# Altium schematic sheet top_level_sheet.SchDoc
size A4; Author: Luis Henrique DAvila Possatti; Organization: University of Campinas; SheetNumber: 1; SheetTotal: 10
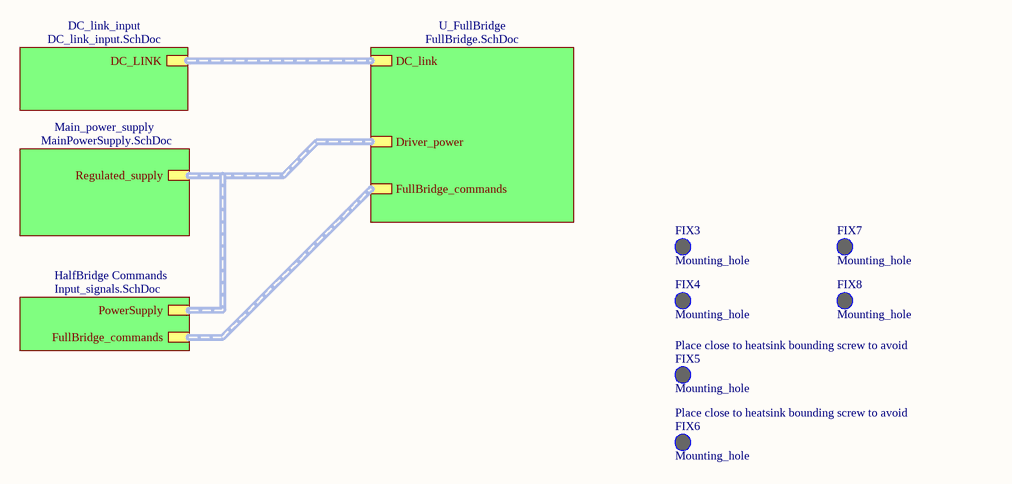
[diagram p0: top_level_sheet.SchDoc]

## Parts
FIX3  Mounting_hole  [Mounting Hole - M3]  (no BOM)
FIX4  Mounting_hole  [Mounting Hole - M3]  (no BOM)
FIX5  Mounting_hole  Additional_infos: Place close to heatsink bounding screw to avoid  [Mounting Hole - M3]  (no BOM)
FIX6  Mounting_hole  Additional_infos: Place close to heatsink bounding screw to avoid  [Mounting Hole - M3]  (no BOM)
FIX7  Mounting_hole  [Mounting Hole - M3]  (no BOM)
FIX8  Mounting_hole  [Mounting Hole - M3]  (no BOM)

## Sub-sheets
DC_link_input = DC_link_input.SchDoc: DC_LINK (harness DC_link)
HalfBridge Commands = Input_signals.SchDoc: FullBridge_commands (harness FullBridge_commands), PowerSupply (harness PowerSupplyOutputs)
Main_power_supply = MainPowerSupply.SchDoc: Regulated_supply (harness PowerSupplyOutputs)
U_FullBridge = FullBridge.SchDoc: DC_link (harness DC_link), FullBridge_commands (harness FullBridge_commands), Driver_power (harness PowerSupplyOutputs)

## Buses and harness runs
harness sheet DC_link_input/DC_LINK = sheet U_FullBridge/DC_link
harness sheet HalfBridge Commands/FullBridge_commands = sheet U_FullBridge/FullBridge_commands
harness sheet HalfBridge Commands/PowerSupply = sheet Main_power_supply/Regulated_supply = sheet U_FullBridge/Driver_power

## Notes on the sheet
- Title
- Size:
- Date:
- A4
- Number:
- Time:
- Revision:
- Sheet
- of
- Author
- Organization
- File:

## Library data of the parts
FIX3-FIX8 = Mounting_hole: Mount Hole, to interface MainBoard with GatedriverBoard or MainBoard with heatsink; value: none; pn: none